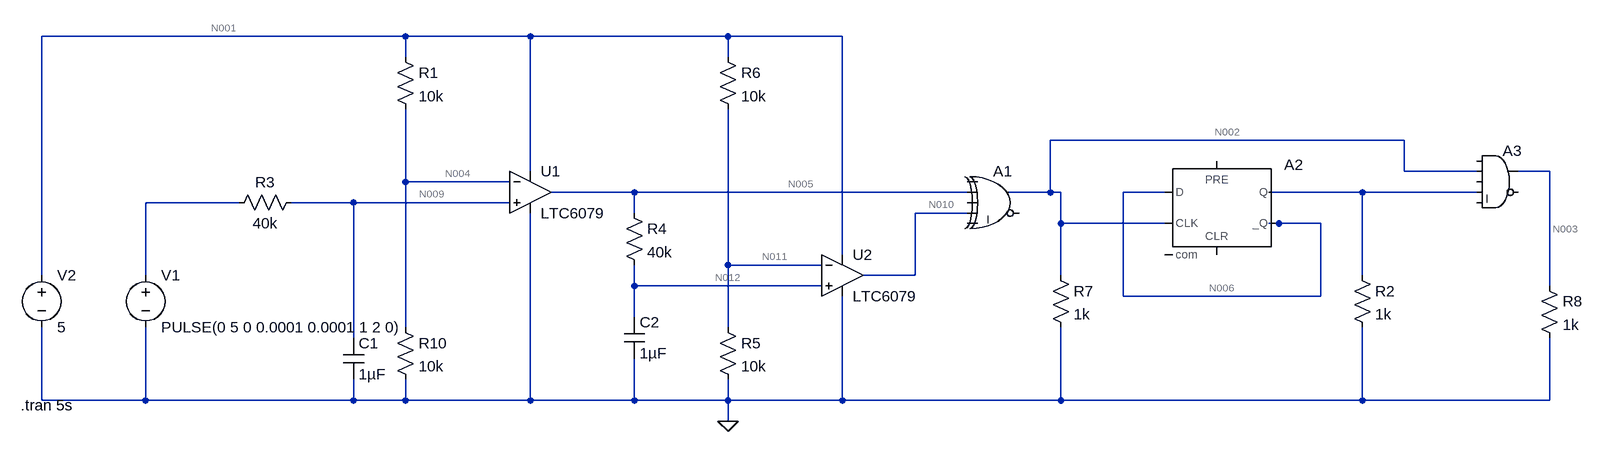
[diagram p0: schematic Pegelanpassung.asc]
Pegelanpassung.asc, the LTspice schematic file:
Version 4
SHEET 1 1784 680
WIRE -32 -80 -592 -80
WIRE 160 -80 -32 -80
WIRE 464 -80 160 -80
WIRE 640 -80 464 -80
WIRE -32 -48 -32 -80
WIRE 464 -48 464 -80
WIRE 1504 80 960 80
WIRE 160 128 160 -80
WIRE 1504 128 1504 80
WIRE 1616 128 1504 128
WIRE 1728 128 1680 128
WIRE -32 144 -32 32
WIRE 128 144 -32 144
WIRE 320 160 192 160
WIRE 832 160 320 160
WIRE 960 160 960 80
WIRE 960 160 896 160
WIRE 976 160 960 160
WIRE 1136 160 1072 160
WIRE 1440 160 1296 160
WIRE 1616 160 1440 160
WIRE -288 176 -432 176
WIRE -112 176 -208 176
WIRE 128 176 -112 176
WIRE 320 192 320 160
WIRE 832 192 752 192
WIRE 976 208 976 160
WIRE 1136 208 976 208
WIRE 1312 208 1296 208
WIRE 1376 208 1312 208
WIRE 640 256 640 -80
WIRE 464 272 464 32
WIRE 608 272 464 272
WIRE -592 288 -592 -80
WIRE -432 288 -432 176
WIRE 752 288 752 192
WIRE 752 288 672 288
WIRE 976 288 976 208
WIRE 1440 288 1440 160
WIRE 320 304 320 272
WIRE 608 304 320 304
WIRE 1728 304 1728 128
WIRE 1072 320 1072 160
WIRE 1376 320 1376 208
WIRE 1376 320 1072 320
WIRE 320 352 320 304
WIRE -32 368 -32 144
WIRE 464 368 464 272
WIRE -112 384 -112 176
WIRE -592 480 -592 368
WIRE -432 480 -432 368
WIRE -432 480 -592 480
WIRE -112 480 -112 448
WIRE -112 480 -432 480
WIRE -32 480 -32 448
WIRE -32 480 -112 480
WIRE 160 480 160 192
WIRE 160 480 -32 480
WIRE 320 480 320 416
WIRE 320 480 160 480
WIRE 464 480 464 448
WIRE 464 480 320 480
WIRE 640 480 640 320
WIRE 640 480 464 480
WIRE 976 480 976 368
WIRE 976 480 640 480
WIRE 1440 480 1440 368
WIRE 1440 480 976 480
WIRE 1728 480 1728 384
WIRE 1728 480 1440 480
WIRE 464 512 464 480
FLAG 464 512 0
SYMBOL res -48 -64 R0
SYMATTR InstName R1
SYMATTR Value 10k
SYMBOL res -48 352 R0
SYMATTR InstName R10
SYMATTR Value 10k
SYMBOL res -192 160 R90
WINDOW 0 0 56 VBottom 2
WINDOW 3 32 56 VTop 2
SYMATTR InstName R3
SYMATTR Value 40k
SYMBOL cap -128 384 R0
SYMATTR InstName C1
SYMATTR Value 1µF
SYMBOL res 304 176 R0
SYMATTR InstName R4
SYMATTR Value 40k
SYMBOL cap 304 352 R0
SYMATTR InstName C2
SYMATTR Value 1µF
SYMBOL res 448 352 R0
SYMATTR InstName R5
SYMATTR Value 10k
SYMBOL res 448 -64 R0
SYMATTR InstName R6
SYMATTR Value 10k
SYMBOL voltage -432 272 R0
WINDOW 123 0 0 Left 0
WINDOW 39 0 0 Left 0
SYMATTR InstName V1
SYMATTR Value PULSE(0 5 0 0.0001 0.0001 1 2 0)
SYMBOL voltage -592 272 R0
WINDOW 123 0 0 Left 0
WINDOW 39 0 0 Left 0
SYMATTR InstName V2
SYMATTR Value 5
SYMBOL Digital\\xor 880 112 R0
SYMATTR InstName A1
SYMBOL res 960 272 R0
SYMATTR InstName R7
SYMATTR Value 1k
SYMBOL Opamps\\LTC6079 160 160 R0
SYMATTR InstName U1
SYMBOL Opamps\\LTC6079 640 288 R0
SYMATTR InstName U2
SYMBOL Digital\\dflop 1216 112 R0
SYMATTR InstName A2
SYMBOL res 1424 272 R0
SYMATTR InstName R2
SYMATTR Value 1k
SYMBOL Digital\\and 1648 80 R0
SYMATTR InstName A3
SYMBOL res 1712 288 R0
SYMATTR InstName R8
SYMATTR Value 1k
TEXT -624 488 Left 2 !.tran 5s

The netlist it stands for:
* Pegelanpassung.asc
R1 N001 N004 10k
R10 N004 0 10k
R3 N009 N008 40k
C1 N009 0 1µF
R4 N005 N012 40k
C2 N012 0 1µF
R5 N011 0 10k
R6 N001 N011 10k
V1 N008 0 PULSE(0 5 0 0.0001 0.0001 1 2 0)
V2 N001 0 5
A1 0 N005 0 N010 0 0 N002 0 XOR
R7 N002 0 1k
XU1 N009 N004 N001 0 N005 LTC6078  ; LTC6079, pins In+ In- V+ V- OUT
XU2 N012 N011 N001 0 N010 LTC6078  ; LTC6079, pins In+ In- V+ V- OUT
A2 N006 0 N002 0 0 N006 N007 0 DFLOP
R2 N007 0 1k
A3 0 N002 0 N007 0 0 N003 0 AND
R8 N003 0 1k
.tran 5s
.lib LTC5.lib
.backanno
.end

* Results of the author's LTspice run, read from the files saved beside the schematic
* Operating Point, zero values left out:
*   V(n001) = 5 V
*   V(n004) = 2.5 V
*   V(n009) = 88.4 nV
*   V(n005) = 26.49 µV
*   V(n012) = 26.58 µV
*   V(n011) = 2.5 V
*   V(n010) = 26.49 µV
*   V(n006) = 1 V
*   I(R6) = 250 µA
*   I(R5) = 250 µA
*   I(R4) = -2.21 pA
*   I(R3) = 2.21 pA
*   I(R10) = 250 µA
*   I(R1) = 250 µA
*   I(V2) = -572.1 µA
*   I(V1) = 2.21 pA
*   Ix(u1:1) = -2.21 pA
*   Ix(u1:3) = 36.04 µA
*   Ix(u1:4) = -36.04 µA
*   Ix(u1:5) = 7.21 pA
*   Ix(u2:1) = -2.21 pA
*   Ix(u2:3) = 36.04 µA
*   Ix(u2:4) = -36.04 µA
*   Ix(u2:5) = 5 pA
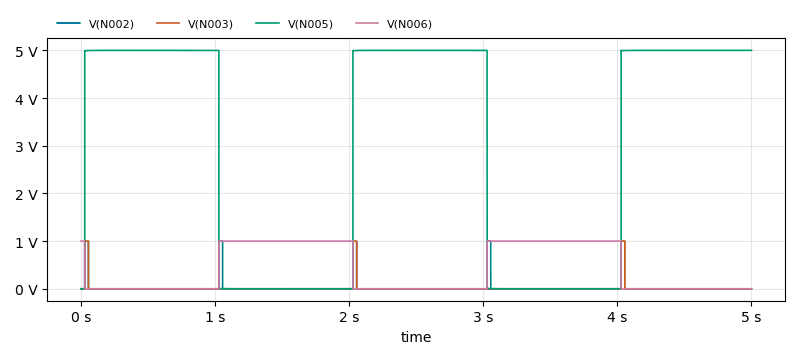
[diagram p1: Transient Analysis of Pegelanpassung.asc, plotted from the saved traces]
* Transient Analysis, 1 run:
*   V(N002): min 0 V, max 999 mV, average 27.92 mV, rms 167 mV, last 0 V
*   V(N003): min 0 V, max 999 mV, average 16.75 mV, rms 129.4 mV, last 0 V
*   V(N005): min 22.69 µV, max 5 V, average 2.972 V, rms 3.855 V, last 5 V
*   V(N006): min 0 V, max 1 V, average 405.5 mV, rms 636.8 mV, last 0 V